# EAGLE schematic PowerModule (EAGLE 7.2.0)
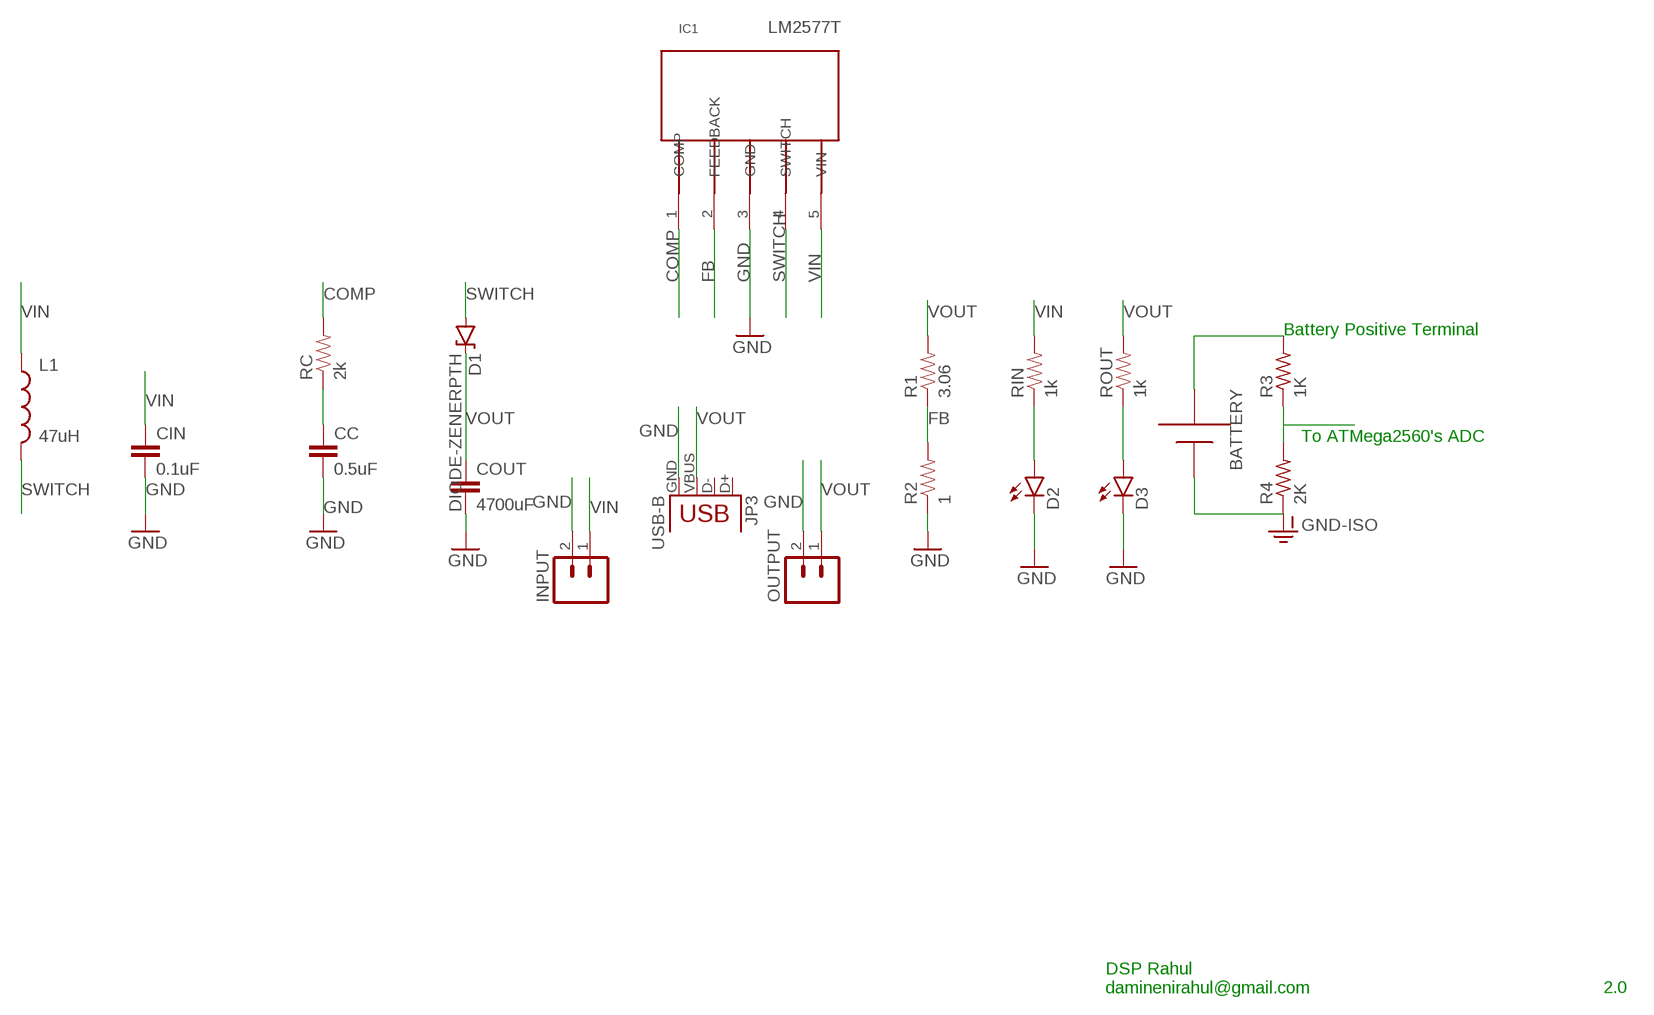
[diagram p0: schematic, sheet 1]

## Parts
BATTERY  4.1V ~ 3.7V  AAA  [12BH412]
CC  0.5uF  CAPEZ  [CAP-PTH-SMALLEZ]
CIN  0.1uF  CAPPTH  [CAP-PTH-SMALL]
COUT  4700uF  CAPPTH3  [CAP-PTH-LARGE]
D1  DIODE-ZENERPTH  [DIODE-ZENER]
D2  LED5MM-KIT  [LED5MM-KIT]
D3  LED5MM-KIT  [LED5MM-KIT]
IC1  LM2577T  [TO220-5]
INPUT  M02POLAR_LOCK  [MOLEX-1X2_LOCK]
JP3  USB-B  USBPTH  [USB-B-PTH]
L1  47uH  INDUCTORRLB0912  [RLB0912]
OUTPUT  M02POLAR_LOCK  [MOLEX-1X2_LOCK]
R1  3.06  RESISTOREZ  [AXIAL-0.3EZ]
R2  1  RESISTOREZ  [AXIAL-0.3EZ]
R3  1K  R-US_0207/9  [0207/9]
R4  2K  R-US_0207/9  [0207/9]
RC  2k  RESISTOREZ  [AXIAL-0.3EZ]
RIN  1k  RESISTOREZ  [AXIAL-0.3EZ]
ROUT  1k  RESISTOREZ  [AXIAL-0.3EZ]

## Nets
COMP: IC1.1(COMP) RC.P$2
FB: IC1.2(FEEDBACK) R1.P$1 R2.P$2
GND: CC.2 CIN.2 COUT.2 D2.K(C) D3.K(C) IC1.3(GND) INPUT.2 JP3.GND OUTPUT.2 R2.P$1
GND-ISO: BATTERY.+ R4.1
N$1: CC.1 RC.P$1
N$2: D2.A RIN.P$1
N$3: D3.A ROUT.P$1
N$4: BATTERY.- R3.2
SWITCH: D1.P$2(A) IC1.4(SWITCH) L1.2
TO-ADC: R3.1 R4.2
VIN: CIN.1 IC1.5(VIN) INPUT.1 L1.1 RIN.P$2
VOUT: COUT.1 D1.P$1(C) JP3.VBUS OUTPUT.1 R1.P$2 ROUT.P$2
Unconnected: JP3.D+ JP3.D-

## Notes on the sheet
- Battery Positive Terminal
- To ATMega2560's ADC
- DSP Rahul
  daminenirahul@gmail.com
- 2.0

## Library data of the parts
BATTERY = adafruit:AAA: AAA PC pin holder Mouser part #12BH412 - but pretty much any 1x AAA battery holder should be the same http://www.ladyada.net/library/pcb/eaglelibrary.html
CC CIN COUT = SparkFun-Capacitors:CAP: Capacitor Standard 0603 ceramic capacitor, and 0.1" leaded capacitor.
D1 = SparkFun-DiscreteSemi:DIODE-ZENER: Zener Diode Production Part - 8199 3.4V Zener Voltage
D2 D3 = SparkFun-LED:LED: LEDs Standard schematic elements and footprints for 5mm, 3mm, 1206, and 0603 sized LEDs. 5mm - Spark Fun Electronics SKU : COM-00529 (and others)
IC1 = lm2577:LM2577T: LM2577 Step-Up Voltage Regulator
INPUT OUTPUT = SparkFun-Connectors:M02: Standard 2-pin 0.1" header. Use with - straight break away headers ( PRT-00116) - right angle break away headers (PRT-00553) - swiss pins (PRT-00743) - machine pins (PRT-00117) - female headers (PRT-00115) Molex polarized connector foot print use with: PRT-08233 with associated crimp pins and housings. 2.54_SCREWTERM for use with PRT-10571. 3.5mm Screw Terminal footprints for PRT-08084 5mm Screw Terminal footprints for use with PRT-08432
JP3 = SparkFun-Connectors:USB: USB Connectors USB-B-PTH is fully proven SKU : PRT-00139/CONN-08278 USB-miniB is fully proven SKU : PRT-00587 USB-A-PCB is untested. USB-A-H is throughly reviewed, but untested. Spark Fun Electronics SKU : PRT-00437 USB-B-SMT is throughly reviewed, but untested. Needs silkscreen touching up. USB-A-S has not been used/tested USB-MB-H has not been used/tested USB-MICROB has been used. CONN-09505; PROD_ID: CONN-08278
L1 = SparkFun-Passives:INDUCTOR: Inductors Basic Inductor/Choke - 0603 and 1206. Footprints are not proven and vary greatly between part numbers. INDUCTOR POWER 3.3UH 4.0A SMD 0.197" L x 0.197" W x 0.177" H (5.00mm x 5.00mm x 4.50mm)
R1 R2 RC RIN ROUT = SparkFun-Resistors:RESISTOR: Resistor Basic schematic elements and footprints for 0603, 1206, and PTH resistors.
R3 R4 = adafruit:R-US_: RESISTOR, American symbol